# Altium schematic sheet Power Path Controllers.SchDoc
size E
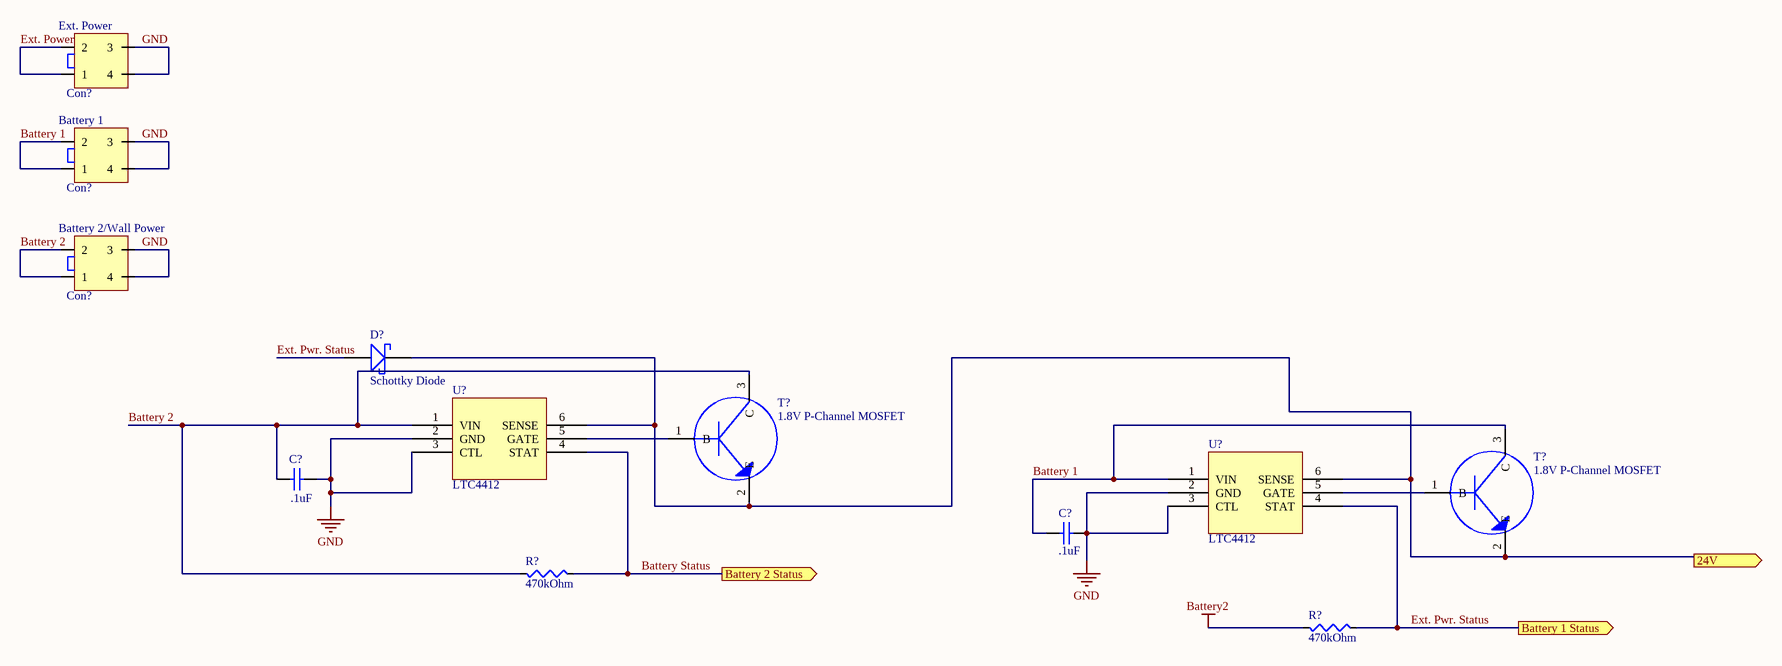
[diagram p0: Power Path Controllers.SchDoc]

## Parts
(Parts that share a designator on the sheet are numbered #1, #2 ... from top to bottom, then left to right.)
C?#1  .1uF  [0805 (2012) Capacitor]
C?#2  .1uF  [0805 (2012) Capacitor]
Con?#1  Ext. Power  [5566-4]
Con?#2  Battery 1  [5566-4]
Con?#3  Battery 2/Wall Power  [5566-4]
D?  Schottky Diode  [DO-41]
R?#1  470kOhm  [R 0805 (2012) RESISTOR]
R?#2  470kOhm  [R 0805 (2012) RESISTOR]
T?#1  1.8V P-Channel MOSFET  [SOT23]
T?#2  1.8V P-Channel MOSFET  [SOT23]
U?#1  LTC4412  [SOT95P245X110-6N]
U?#2  LTC4412  [SOT95P245X110-6N]

## Ports
24V (out), Battery 1 Status (out), Battery 2 Status (out)

## Nets
Battery2: R?#2.2
GND: C?#1.2 C?#2.2 Con?#1.3 Con?#1.4 Con?#2.3 Con?#2.4 Con?#3.3 Con?#3.4 U?#1.2(GND) U?#1.3(CTL) U?#2.2(GND) U?#2.3(CTL)
24V: D?.K T?#1.2(E) T?#2.2(E) U?#1.6(SENSE) U?#2.6(SENSE) ; port 24V
Battery 1: C?#2.1 Con?#2.1 Con?#2.2 T?#2.3(C) U?#2.1(VIN)
Battery 2: C?#1.1 Con?#3.1 Con?#3.2 R?#1.2 T?#1.3(C) U?#1.1(VIN)
Battery Status: R?#1.1 U?#1.4(STAT) ; port Battery 2 Status
Ext. Power: Con?#1.1 Con?#1.2
Ext. Pwr. Status: D?.A R?#2.1 U?#2.4(STAT) ; port Battery 1 Status
NetT?#1_1: T?#1.1(B) U?#1.5(GATE)
NetT?#2_1: T?#2.1(B) U?#2.5(GATE)

## Library data of the parts
C?#1 C?#2 = Capacitor (non-polarized): Capacitor; Value: .1uF
Con?#1-Con?#3 = 5566-4: 4.20mm (.165") Pitch Mini-Fit Jr.™ Header, Dual Row, Vertical, without Snap-in Plastic Peg PCB Lock, 4 Circuits, PA Polyamide Nylon 6/6 94V-2, Tin (Sn) Plating, without Drain Holes
R?#1 R?#2 = Resistor: Value: 0Ohm
T?#1 T?#2 = Transistor
U?#1 U?#2 = LTC4412: Low Loss Power Path Controller in Thin SOT